# EAGLE schematic stacja (EAGLE 8.2.0)
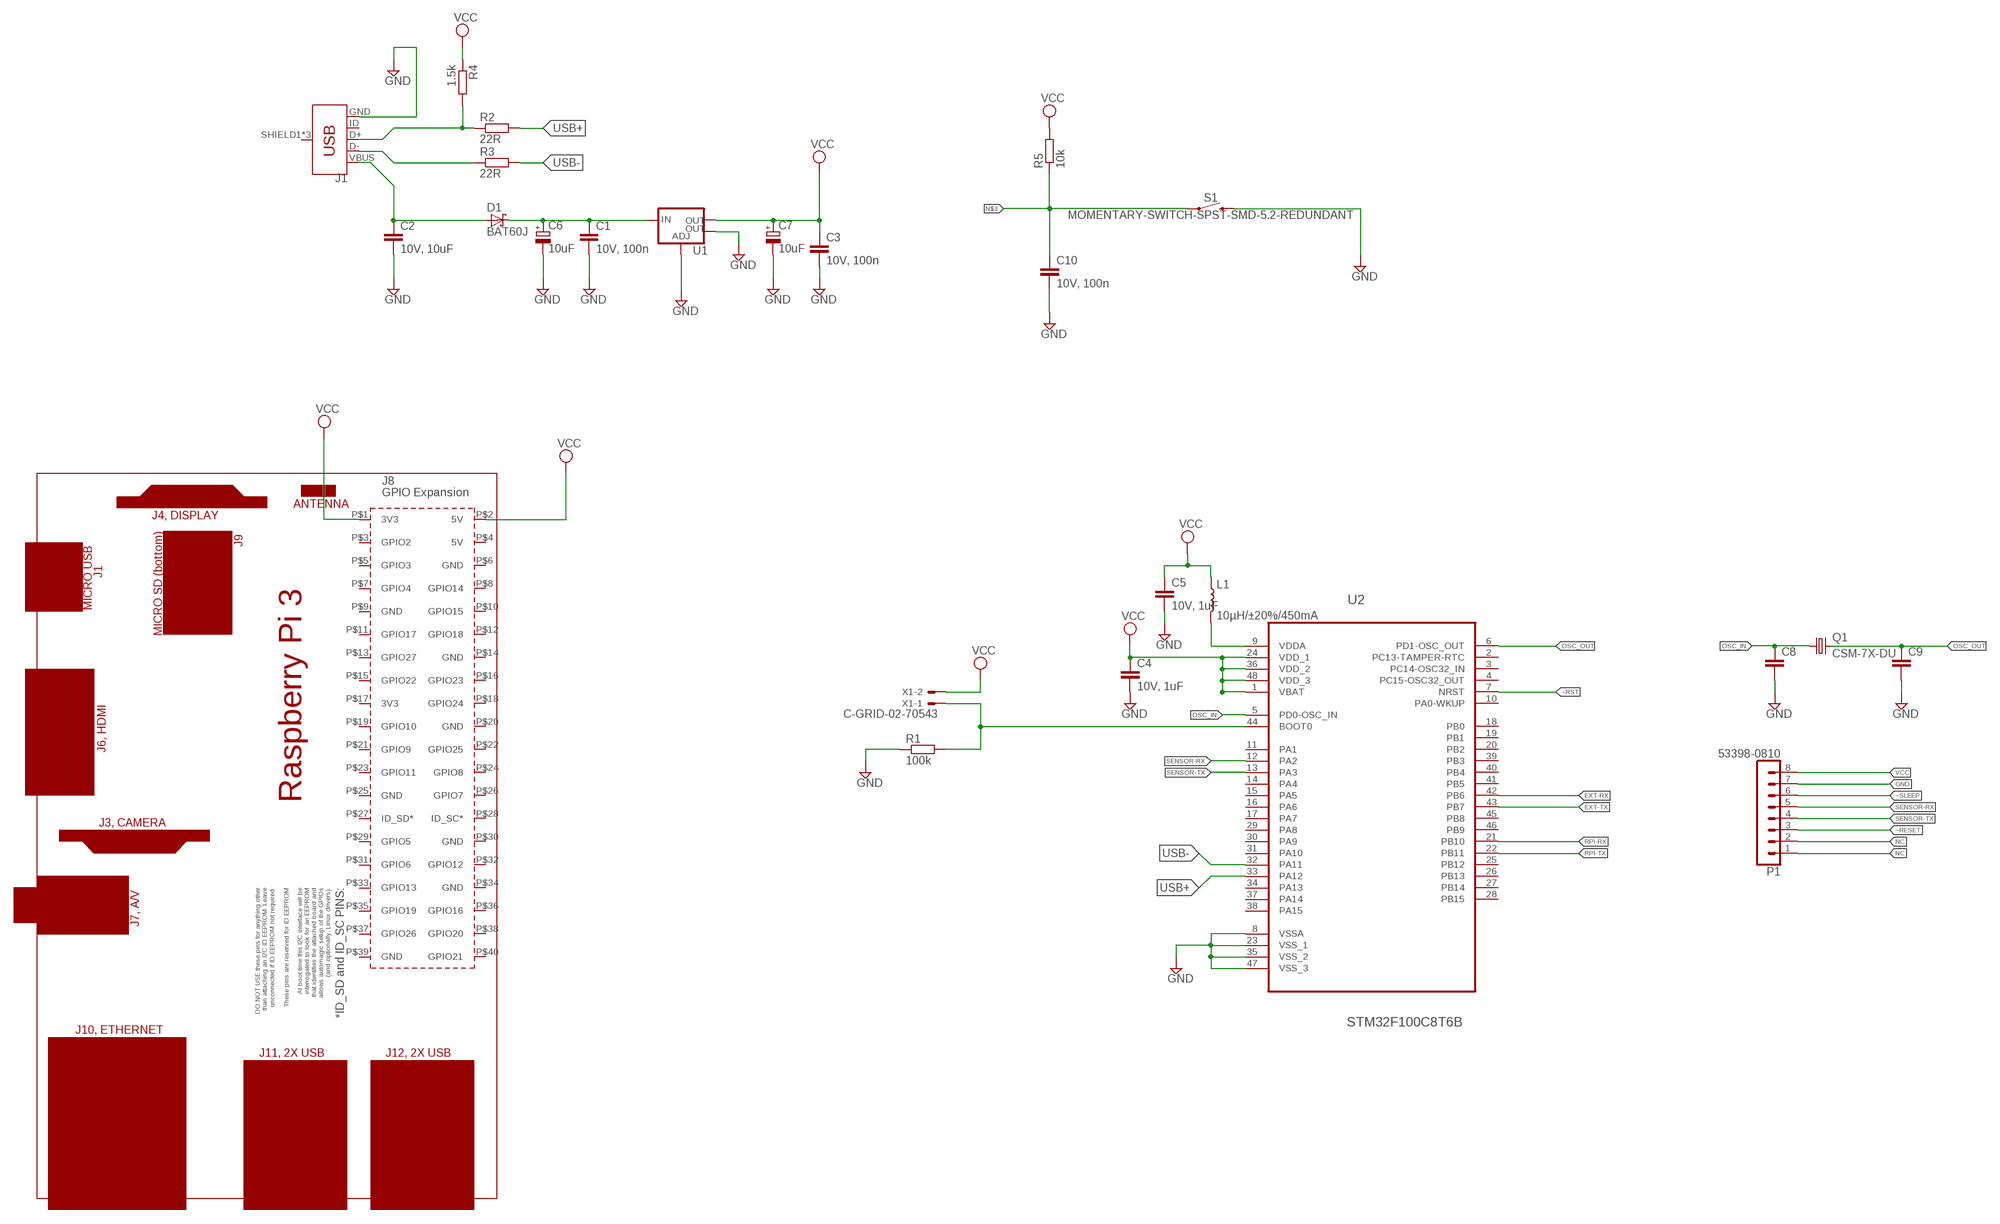
[diagram p0: schematic, sheet 1]

## Parts
C1  10V, 100n  C-EUC0805K  [C0805K]
C2  10V, 10uF  C-EUC0805K  [C0805K]
C3  10V, 100n  C-EUC0805K  [C0805K]
C4  10V, 1uF  C-EUC0805K  [C0805K]
C5  10V, 1uF  C-EUC0805K  [C0805K]
C6  10uF  CPOL-EUSANYO_SMD_B6  [SANYO-OSCON_SMD_B6]
C7  10uF  CPOL-EUSANYO_SMD_B6  [SANYO-OSCON_SMD_B6]
C8  C-EUC0805K  [C0805K]
C9  C-EUC0805K  [C0805K]
C10  10V, 100n  C-EUC0805K  [C0805K]
D1  BAT60J  [SOD323_ST]
J1  USB_MICRO-B_FEMALE-SMT  [USB-B-MICRO-SMD]
L1  10µH/±20%/450mA  INDUCTOR-0805-3.3UH  [0805]
P1  53398-0810  [53398-0810]
PCB1  RPI3  [RPI3]
Q1  CSM-7X-DU  [CSM-7X-DU]
R1  100k  R-EU_R0805  [R0805]
R2  22R  R-EU_R0805  [R0805]
R3  22R  R-EU_R0805  [R0805]
R4  1.5k  R-EU_R0805  [R0805]
R5  10k  R-EU_R0805  [R0805]
S1  MOMENTARY-SWITCH-SPST-SMD-5.2-REDUNDANT  [TACTILE_SWITCH_SMD_5.2MM]
U1  V_REG_LM1117SOT223  [SOT223]
U2  STM32F100C8T6B  [QFP50P900X900X160-48N]
X1  C-GRID-02-70543  [70543-02]

## Nets
EXT-RX: U2.42(PB6)
EXT-TX: U2.43(PB7)
GND: C1.2 C2.2 C3.2 C4.2 C5.2 C6.- C7.- C8.2 C9.2 C10.2 J1.GND P1.7 R1.1 S1.3 S1.4 U1.1(ADJ) U1.4(OUT) U2.8(VSSA) U2.23(VSS_1) U2.35(VSS_2) U2.47(VSS_3)
N$1: R1.2 U2.44(BOOT0) X1.1
N$2: L1.2 U2.9(VDDA)
N$3: C10.1 R5.1 S1.1 S1.2
N$4: J1.D+ R2.1 R4.2
N$5: J1.D- R3.1
N$6: C1.1 C6.+ D1.C U1.3(IN)
N$8: C2.1 D1.A J1.VBUS
NC: P1.1 P1.2
OSC_IN: C8.1 Q1.1 U2.5(PD0-OSC_IN)
OSC_OUT: C9.1 Q1.2 U2.6(PD1-OSC_OUT)
RPI-RX: U2.21(PB10)
RPI-TX: U2.22(PB11)
SENSOR-RX: P1.5 U2.12(PA2)
SENSOR-TX: P1.4 U2.13(PA3)
USB+: R2.2 U2.33(PA12)
USB-: R3.2 U2.32(PA11)
VCC: C3.1 C4.1 C5.1 C7.+ L1.1 P1.8 PCB1.P$1(3V3) PCB1.P$2(5V) R4.1 R5.2 U1.2(OUT) U2.1(VBAT) U2.24(VDD_1) U2.36(VDD_2) U2.48(VDD_3) X1.2
~RESET: P1.3
~RST: U2.7(NRST)
~SLEEP: P1.6
Unconnected: J1.ID J1.SHIELD1(SHIELD) J1.SHIELD2(SHIELD) J1.SHIELD3(SHIELD) PCB1.P$3(GPIO2) PCB1.P$4(5V) PCB1.P$5(GPIO3) PCB1.P$6(GND) PCB1.P$7(GPIO4) PCB1.P$8(GPIO14) PCB1.P$9(GND) PCB1.P$10(GPIO15) PCB1.P$11(GPIO17) PCB1.P$12(GPIO18) PCB1.P$13(GPIO27) PCB1.P$14(GND) PCB1.P$15(GPIO22) PCB1.P$16(GPIO23) PCB1.P$17(3V3) PCB1.P$18(GPIO24) PCB1.P$19(GPIO10) PCB1.P$20(GND) PCB1.P$21(GPIO9) PCB1.P$22(GPIO25) PCB1.P$23(GPIO11) PCB1.P$24(GPIO8) PCB1.P$25(GND) PCB1.P$26(GPIO7) PCB1.P$27(ID_SD*) PCB1.P$28(ID_SC*) PCB1.P$29(GPIO5) PCB1.P$30(GND) PCB1.P$31(GPIO6) PCB1.P$32(GPIO12) PCB1.P$33(GPIO13) PCB1.P$34(GND) PCB1.P$35(GPIO19) PCB1.P$36(GPIO16) PCB1.P$37(GPIO26) PCB1.P$38(GPIO20) PCB1.P$39(GND) PCB1.P$40(GPIO21) U2.2(PC13-TAMPER-RTC) U2.3(PC14-OSC32_IN) U2.4(PC15-OSC32_OUT) U2.10(PA0-WKUP) U2.11(PA1) U2.14(PA4) U2.15(PA5) U2.16(PA6) U2.17(PA7) U2.18(PB0) U2.19(PB1) U2.20(PB2) U2.25(PB12) U2.26(PB13) U2.27(PB14) U2.28(PB15) U2.29(PA8) U2.30(PA9) U2.31(PA10) U2.34(PA13) U2.37(PA14) U2.38(PA15) U2.39(PB3) U2.40(PB4) U2.41(PB5) U2.45(PB8) U2.46(PB9)

## Library data of the parts
C1-C5 C8-C10 = rcl:C-EU: CAPACITOR, European symbol
C6 C7 = rcl:CPOL-EU: POLARIZED CAPACITOR, European symbol
D1 = diode:BAT60J: Schottky barrier diode Source: www.st.com, BAT60J.pdf
J1 = SparkFun-Connectors:USB_MICRO-B: USB Type Micro-B Connector Male/female and PTH/SMT variants SparkFun Products: SparkFun microB USB Breakout <https://www.sparkfun.com/products/12035> SparkFun USB microB Plug Breakout <https://www.sparkfun.com/products/10031> SparkFun ESP8266 Thing <https://www.sparkfun.com/products/13231>; PROD_ID: CONN-11752
L1 = SparkFun-Coils:INDUCTOR: Inductors Resist changes in electrical current. Basically a coil of wire. SparkFun Products: SparkFun Load Cell Amplifier - HX711 <https://www.sparkfun.com/products/13879> IOIO-OTG - V2.2 <https://www.sparkfun.com/products/13613>; PROD_ID: NDUC-13076; VALUE: 3.3µH/±20%/450mA
P1 = molex-pico:53398-0810: HEADER
PCB1 = e14_Rpi3_RevA:RPI3: Device for Raspberry Pi 3 board created by Dave Young for www.element14.com More information and support community is available at https://www.element14.com/community/community/raspberry-pi
Q1 = crystal:CSM-7X-DU: SMD CRYSTAL Source: www.ecsxtal.com .. Crystal 3.6864MHz CSM_7X_DU.PDF; OC_FARNELL: unknown; OC_NEWARK: unknown
R1 R5 = rcl:R-EU_: RESISTOR, European symbol
R2-R4 = resistor:R-EU_: RESISTOR, European symbol
S1 = SparkFun-Switches:MOMENTARY-SWITCH-SPST: Momentary Switch (Pushbutton) - SPST Normally-open (NO) SPST momentary switches (buttons, pushbuttons). Variants PTH-12MM - 12mm square, through-hole Momentary Pushbutton Switch - 12mm Square <https://www.sparkfun.com/products/9190> (COM-09190) PTH-6.0MM, PTH-6.0MM-KIT - 6.0mm square, through-hole Mini Pushbutton Switch <https://www.sparkfun.com/products/97> (COM-00097) KIT package intended for soldering kit's - only one side of pads' copper is exposed. PTH-RIGHT-ANGLE-KIT - Right-angle, through-hole Right Angle Tactile Button <https://www.sparkfun.com/products/10791> - Used on SparkFun BigTime Watch Kit <https://www.sparkfun.com/products/11734> SMD-12MM - 12mm square, surface-mount Tactile Button - SMD (12mm) <https://www.sparkfun.com/products/12993> (COM-12993) Used on SparkFun PicoBoard <https://www.sparkfun.com/products/11888> SMD-4.5MM - 4.5mm Square Trackball Switch Used on SparkFun Blackberry Trackballer Breakout <https://www.sparkfun.com/products/13169> SMD-4.6MMX2.8MM - 4.60mm x 2.80mm, surface mount Used on SparkFun SAMD21 Mini Breakout <https://www.sparkfun.com/products/13664> SMD-5.2MM, SMD-5.2-REDUNDANT - 5.2mm square, surface-mount Mini Pushbutton Switch - SMD <https://www.sparkfun.com/products/8720> (COM-08720) Used on Arduino Pro Mini <https://www.sparkfun.com/products/11114> REDUNDANT package connects both switch circuits together SMD-6.0X3.5MM - 6.0 x 3.5mm, surface mount Momentary Reset Switch SMD <https://www.sparkfun.com/products/8229> (COM-08229) SMD-6.2MM-TALL - 6.2mm square, surface mount Tactile Button - SMD (6mm) <https://www.sparkfun.com/products/12992> Used on SparkFun Digital Sandbox <https://www.sparkfun.com/products/12651> SMD-RIGHT-ANGLE - Right-angle, surface mount Used on SparkFun Block for Intel® Edison - Arduino <https://www.sparkfun.com/products/13036>; PROD_ID: SWCH-08247; SF_SKU: COM-08720
U1 = SparkFun-IC-Power:V_REG_LM1117: Voltage Regulator LM1117 Standard adjustable voltage regulator but in SMD form. Spark Fun Electronics SKU : COM-00595; PROD_ID: VREG-08170
U2 = ST Microelctronics_By_element14_Batch_1:STM32F100C8T6B: ARM-based 32-bit MCU; MPN: STM32F100C8T6B; OC_FARNELL: 1838511; OC_NEWARK: 76R0988; PACKAGE: LQFP-48; SUPPLIER: STMircroelectronics
X1 = con-molex:C-GRID-02: CONNECTOR wire to board 2.54 mm (0.100") pitch header; OC_FARNELL: unknown; OC_NEWARK: unknown